# Altium schematic sheet currentSensor.SchDoc
size A4
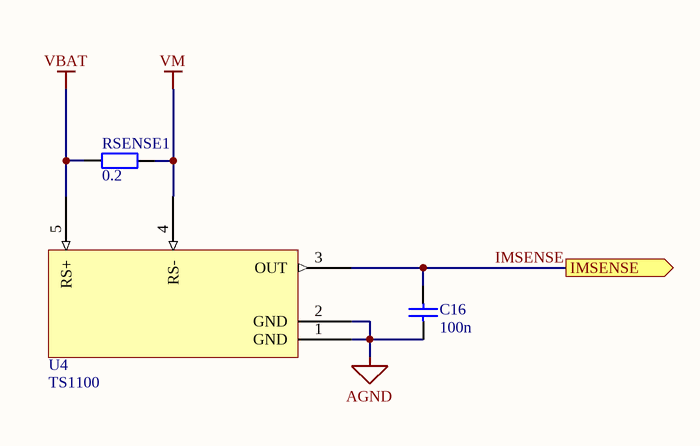
[diagram p0: currentSensor.SchDoc]

## Parts
C16  100n  [CAP 0603/1608]
RSENSE1  0.2  [RES 0603/1608]
U4  TS1100  [SOT23-5]

## Ports
IMSENSE (out)

## Nets
AGND: C16.2 U4.1(GND) U4.2(GND)
VBAT: RSENSE1.1 U4.5(RS+)
VM: RSENSE1.2 U4.4(RS-)
IMSENSE: C16.1 U4.3(OUT) ; port IMSENSE

## Library data of the parts
C16 = Cap: MULTICOMP  MCSH21B104K100CT  Condensateur céramique multicouche CMS, 0805 [2012 Metric], 0.1 µF, 10 V, ± 10%, X7R, Série MCSH; Fournisseur: Farnell; RefFournisseur: 1856422; Fabricant: MULTICOMP; Footprint: 0603; RefFabricant: MCSH21B104K100CT; Value: 100n
RSENSE1 = Res2: SUSUMU  RL1220S-R20-F  Résistance CMS de détection de courant, 0.2 ohm, 250 mW, 0805 [2012 Metric], ± 1%, Série RL; RefFournisseur: 1653327; Fournisseur: Farnell; RefFabricant: RL1220S-R20-F; Fabricant: SUSUMU; Value: 0.2; Footprint: 0603
U4 = TS1100: SILICON LABS  TS1100-25EG5T  Amplificateur de mesure de courant, Précision, 1 amplificateur, SOT-23, 5 Broche(s), -40 °C, 105 °C; Fournisseur: Farnell; RefFournisseur: 2373811; Fabricant: Silicon Lab; Footprint: SOT-23 - 5; RefFabricant: TS1100-25EG5T